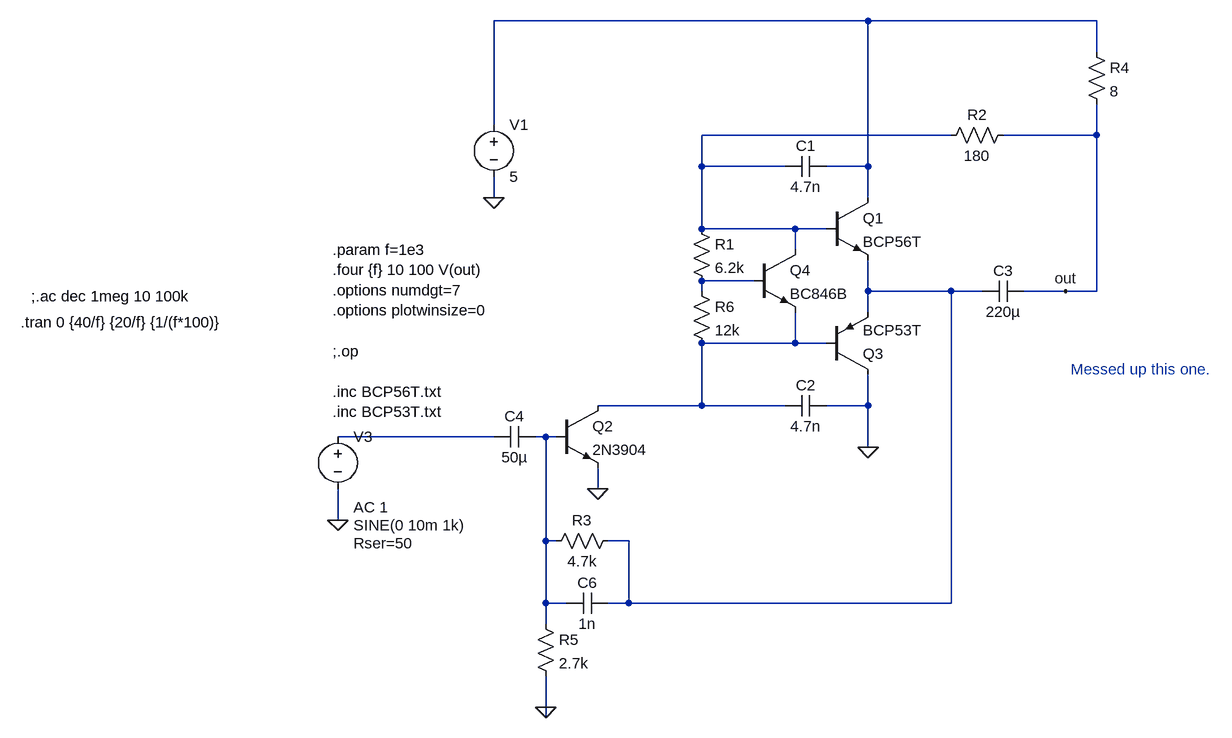
[diagram p0: schematic ITT_Pony13_BCP5x.asc]
ITT_Pony13_BCP5x.asc, the LTspice schematic file:
Version 4
SHEET 1 928 836
WIRE 384 -240 -192 -240
WIRE 736 -240 384 -240
WIRE 736 -192 736 -240
WIRE -192 -80 -192 -240
WIRE 512 -64 128 -64
WIRE 736 -64 736 -112
WIRE 736 -64 592 -64
WIRE 128 -16 128 -64
WIRE 256 -16 128 -16
WIRE 384 -16 384 -240
WIRE 384 -16 320 -16
WIRE -192 32 -192 0
WIRE 384 32 384 -16
WIRE 128 80 128 -16
WIRE 272 80 128 80
WIRE 320 80 272 80
WIRE 272 112 272 80
WIRE 208 160 128 160
WIRE 128 176 128 160
WIRE 384 176 384 128
WIRE 512 176 384 176
WIRE 560 176 512 176
WIRE 688 176 624 176
WIRE 736 176 736 -64
WIRE 736 176 688 176
WIRE 384 208 384 176
WIRE 272 256 272 208
WIRE 272 256 128 256
WIRE 320 256 272 256
WIRE 128 352 128 256
WIRE 128 352 -32 352
WIRE 256 352 128 352
WIRE 384 352 384 304
WIRE 384 352 320 352
WIRE -192 400 -432 400
WIRE -112 400 -128 400
WIRE -96 400 -112 400
WIRE 384 416 384 352
WIRE -32 480 -32 448
WIRE -432 528 -432 480
WIRE -112 560 -112 400
WIRE -96 560 -112 560
WIRE 16 560 -16 560
WIRE -112 656 -112 560
WIRE -80 656 -112 656
WIRE 16 656 16 560
WIRE 16 656 -16 656
WIRE 512 656 512 176
WIRE 512 656 16 656
WIRE -112 688 -112 656
WIRE -112 816 -112 768
WIRE -112 832 -112 816
FLAG -192 32 0
FLAG -432 528 0
FLAG -32 480 0
FLAG 384 416 0
FLAG 688 176 out
FLAG -112 816 0
SYMBOL npn 320 32 R0
SYMATTR InstName Q1
SYMATTR Value BCP56T
SYMATTR Prefix X
SYMBOL npn -96 352 R0
SYMATTR InstName Q2
SYMATTR Value 2N3904
SYMBOL pnp 320 304 M180
SYMATTR InstName Q3
SYMATTR Value BCP53T
SYMATTR Prefix X
SYMBOL cap 320 -32 R90
WINDOW 0 0 32 VBottom 2
WINDOW 3 32 32 VTop 2
SYMATTR InstName C1
SYMATTR Value 4.7n
SYMBOL cap 320 336 R90
WINDOW 0 0 32 VBottom 2
WINDOW 3 32 32 VTop 2
SYMATTR InstName C2
SYMATTR Value 4.7n
SYMBOL cap 624 160 R90
WINDOW 0 0 32 VBottom 2
WINDOW 3 32 32 VTop 2
SYMATTR InstName C3
SYMATTR Value 220µ
SYMBOL res 608 -80 R90
WINDOW 0 0 56 VBottom 2
WINDOW 3 32 56 VTop 2
SYMATTR InstName R2
SYMATTR Value 180
SYMBOL voltage -192 -96 R0
SYMATTR InstName V1
SYMATTR Value 5
SYMBOL cap -128 384 R90
WINDOW 0 0 32 VBottom 2
WINDOW 3 32 32 VTop 2
SYMATTR InstName C4
SYMATTR Value 50µ
SYMBOL res 0 544 R90
WINDOW 0 0 56 VBottom 2
WINDOW 3 32 56 VTop 2
SYMATTR InstName R3
SYMATTR Value 4.7k
SYMBOL res 720 -208 R0
SYMATTR InstName R4
SYMATTR Value 8
SYMBOL voltage -432 384 R0
WINDOW 3 24 152 Left 2
WINDOW 123 24 124 Left 2
WINDOW 39 24 180 Left 2
SYMATTR Value SINE(0 10m 1k)
SYMATTR Value2 AC 1
SYMATTR SpiceLine Rser=50
SYMATTR InstName V3
SYMBOL res -128 672 R0
SYMATTR InstName R5
SYMATTR Value 2.7k
SYMBOL cap -16 640 R90
WINDOW 0 0 32 VBottom 2
WINDOW 3 32 32 VTop 2
SYMATTR InstName C6
SYMATTR Value 1n
SYMBOL res 112 64 R0
SYMATTR InstName R1
SYMATTR Value 6.2k
SYMBOL res 112 160 R0
SYMATTR InstName R6
SYMATTR Value 12k
SYMBOL npn 208 112 R0
SYMATTR InstName Q4
SYMATTR Value BC846B
TEXT -440 112 Left 2 !.param f=1e3\n.four {f} 10 100 V(out)\n.options numdgt=7\n.options plotwinsize=0\n \n;.op\n \n.inc BCP56T.txt\n.inc BCP53T.txt
TEXT -920 224 Left 2 !.tran 0 {40/f} {20/f} {1/(f*100)}
TEXT -904 184 Left 2 !;.ac dec 1meg 10 100k
TEXT 696 296 Left 2 ;Messed up this one.

The netlist it stands for:
* ITT_Pony13_BCP5x.asc
XQ1 N001 N002 N004 BCP56T  ; pins C B E
Q2 N005 N007 0 0 2N3904
XQ3 0 N005 N004 BCP53T  ; pins C B E
C1 N001 N002 4.7n
C2 0 N005 4.7n
C3 out N004 220µ
R2 out N002 180
V1 N001 0 5
C4 N007 N006 50µ
R3 N004 N007 4.7k
R4 N001 out 8
V3 N006 0 SINE(0 10m 1k) AC 1 Rser=50
R5 N007 0 2.7k
C6 N004 N007 1n
R1 N002 N003 6.2k
R6 N003 N005 12k
Q4 N002 N003 N005 0 BC846B
.model NPN NPN
.model PNP PNP
.lib standard.bjt
.param f=1e3
.four {f} 10 100 V(out)
.options numdgt=7
.options plotwinsize=0
;.op
.inc BCP56T.txt
.inc BCP53T.txt
.tran 0 {40/f} {20/f} {1/(f*100)}
;.ac dec 1meg 10 100k
* Messed up this one.
.backanno
.end